# Altium schematic sheet Power.SchDoc: RespiraWorks
size A3; CompanyName: RespiraWorks; DrawnBy: E. Chiu; Organization: Altium; DocumentNumber: 2; Revision: A1; SheetNumber: 2; SheetTotal: 8; PageSetup: Record=PageOptions|CenterHorizontal=True|CenterVertical=True|PrintScale=0.67|XCorrection=1.00|YCorrection=1.00|PrintKind=0|BorderSize=5000000|LeftOffset=0|BottomOffset=0|Orientation=2|PaperLength=1000|PaperWidth=1000|Scale=100|PaperSource=276|PrintQuality=-3|MediaType=1|DitherType=10|PrintScaleMode=1|PaperKind=11"x17" 279.4x431.8mm|PaperIndex=3; ProjectName: FALCON 3S
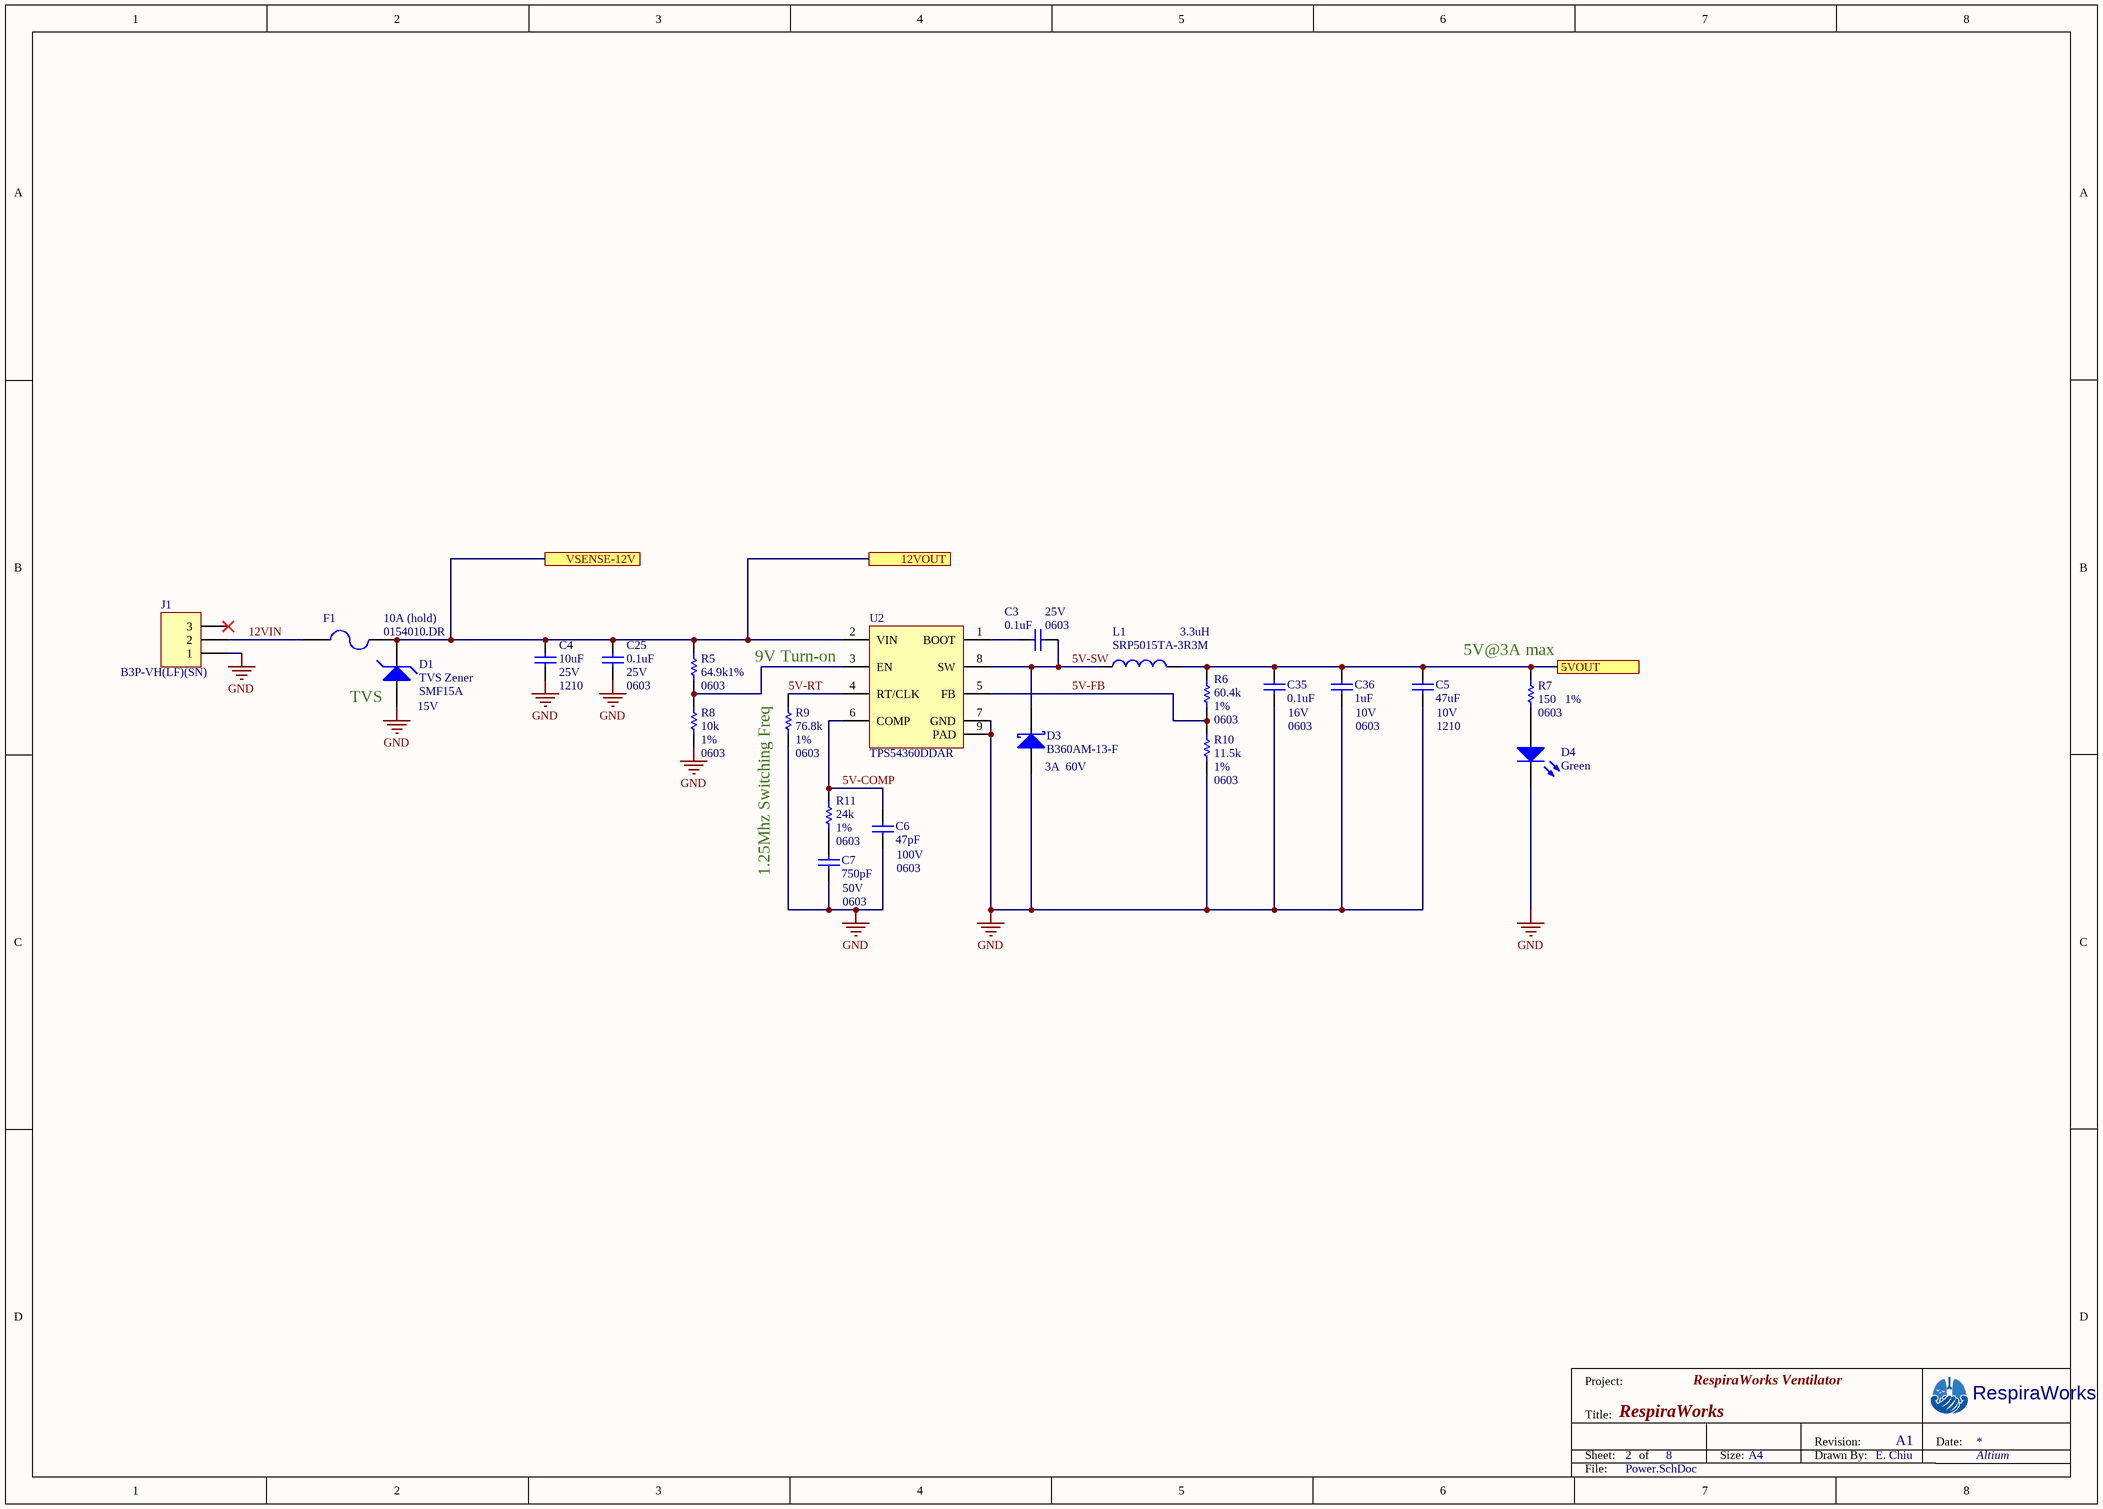
[diagram p0: Power.SchDoc]

## Parts
C3  value 0.1uF  Voltage: 25V  PCB Package: 0603  [CAP0603]  (hidden comment: CAP 0603)
C4  value 10uF  Voltage: 25V  PCB Package: 1210  [CAP1210]  (hidden comment: CAP 1210)
C5  value 47uF  Voltage: 10V  PCB Package: 1210  [CAP1210]  (hidden comment: CAP 1210)
C6  value 47pF  Voltage: 100V  PCB Package: 0603  [CAP0603]  (hidden comment: CAP 0603)
C7  value 750pF  Voltage: 50V  PCB Package: 0603  [CAP0603]  (hidden comment: CAP 0603)
C25  value 0.1uF  Voltage: 25V  PCB Package: 0603  [CAP0603]  (hidden comment: CAP 0603)
C35  value 0.1uF  Voltage: 16V  PCB Package: 0603  [CAP0603]  (hidden comment: CAP 0603)
C36  value 1uF  Voltage: 10V  PCB Package: 0603  [CAP0603]  (hidden comment: CAP 0603)
D1  TVS Zener  Vr: 15V  [SOD-123F]
D3  Reverse Voltage: 60V  I(max): 3A  [DO-214AC]  (hidden comment: *)
D4  value Green  [LED0603]  (hidden comment: LED 0603)
F1  value 10A (hold)  Manufacturer P/N: 0154010.DR  [0154]  (hidden comment: Fast Blow)
J1  B3P-VH(LF)(SN)  [B3P-VH(LF)(SN)]
L1  value 3.3uH  [SRP5015]  (hidden comment: SRP5015TA-3R3M)
R5  value 64.9k  PCB Package: 0603  Tolerance: 1%  [RES0603]  (hidden comment: RES 0603)
R6  value 60.4k  PCB Package: 0603  Tolerance: 1%  [RES0603]  (hidden comment: RES 0603)
R7  value 150  PCB Package: 0603  Tolerance: 1%  [RES0603]  (hidden comment: RES 0603)
R8  value 10k  PCB Package: 0603  Tolerance: 1%  [RES0603]  (hidden comment: RES 0603)
R9  value 76.8k  PCB Package: 0603  Tolerance: 1%  [RES0603]  (hidden comment: RES 0603)
R10  value 11.5k  PCB Package: 0603  Tolerance: 1%  [RES0603]  (hidden comment: RES 0603)
R11  value 24k  PCB Package: 0603  Tolerance: 1%  [RES0603]  (hidden comment: RES 0603)
U2  Manufacturer P/N: TPS54360DDAR  [DDA]  (hidden comment: TPS54360)

## Ports
5VOUT, 12VOUT, VSENSE-12V

## Nets
GND: C4.1 C5.1 C6.1 C7.1 C25.2 C35.2 C36.2 D1.A D3.A D4.K J1.1 R8.1 R9.1 R10.1 U2.7(GND) U2.9(PAD)
5V-COMP: C6.2 R11.2 U2.6(COMP)
5V-FB: R6.1 R10.2 U2.5(FB)
5V-RT: R9.2 U2.4(RT/CLK)
5V-SW: C3.2 D3.K L1.1 U2.8(SW)
5VOUT: C5.2 C35.1 C36.1 L1.2 R6.2 R7.2 ; port 5VOUT
12VIN: F1.1 J1.2
12VOUT: C4.2 C25.1 D1.K F1.2 R5.2 U2.2(VIN) ; port VSENSE-12V, port 12VOUT
NetC3_1: C3.1 U2.1(BOOT)
NetC7_2: C7.2 R11.1
NetD4_A: D4.A R7.1
NetR5_1: R5.1 R8.2 U2.3(EN)

Not connected (* = marked no-connect by the designer): J1 3*

## Notes on the sheet
- (near D1) TVS
- 9V Turn-on
- (near R7) 5V@3A max
- (near R9) 1.25Mhz Switching Freq
- Project:
- RespiraWorks Ventilator
- Title:
- Sheet:
- of
- Size:
- A4
- Drawn By:
- Revision:
- Date:
- File:

## Library data of the parts
C3 C25 = CAP 0603: Manufacturer P/N: CC0603KRX7R8BB104; Manufacturer: Yageo; Type: X7R; Do Not Populate: *
C4 = CAP 1210: Manufacturer P/N: GRM32DR71E106KA12L; Manufacturer: Murata; Type: X7R; Do Not Populate: *
C5 = CAP 1210: Manufacturer P/N: GRM32ER71A476KE15L; Manufacturer: Murata; Type: X7R; Do Not Populate: *
C6 = CAP 0603: Manufacturer P/N: C0603C470J1GACTU; Manufacturer: Kemet; Type: NP0; Do Not Populate: *
C7 = CAP 0603: Manufacturer P/N: CL10B751KB8NNNC; Manufacturer: Samsung; Type: X7R; Do Not Populate: *
C35 = CAP 0603: Manufacturer P/N: CC0603KRX7R7BB104; Manufacturer: Yageo; Type: X7R; Do Not Populate: *
C36 = CAP 0603: Manufacturer P/N: CC0603KRX7R6BB105; Manufacturer: Yageo; Type: X7R; Do Not Populate: *
D1 = SMF15A: TVS Diode, Zener, 15V Standoff, 24V Clamp, 8.2A; Manufacturer: Littelfuse; Vbr(min): 16.7V; Do Not Populate: *; PCB Package: SOD-123F; I(pulse): 8.2A; Manufacturer P/N: SMF15A
D3 = B360AM-13-F: DIODE SCHOTTKY 60V 3A SMA; Manufacturer: Diodes Inc.; PCB Package: DO-214AC (SMA); Do Not Populate: *; Type: Schottky; Manufacturer P/N: B360AM-13-F
D4 = LED 0603: Manufacturer P/N: LTST-C191KGKT; Manufacturer: Lite-On; PCB Package: 0603; Vf: 2V; Intensity: 35mcd@20mA; Color: Green; Do Not Populate: *
F1 = 0154010: Fast Blow Nano Fuse in Holder, 10A, 125V; Manufacturer: Littelfuse; V(max): 125V AC/DC; I(hold): 10A; I(trip): 10A
J1 = B3P-VH(LF)(SN): JST-VH HEADER VERT 3POS 3.96MM; Manufacturer: JST; Do Not Populate: *; Manufacturer P/N: B3P-VH(LF)(SN)
L1 = SRP5015TA-3R3M: Inductor, 501 Series, Shielded 2.2uH, 4A; Manufacturer: Bourns; I(rms): 3.2A; I(sat): 4.5A; DCR: 78mohm; Do Not Populate: *; PCB Package: SRP5015; Manufacturer P/N: SRP5015TA-3R3M
R5 = RES 0603: Manufacturer P/N: RC0603FR-0764K9L; Manufacturer: Yageo; Do Not Populate: *
R6 = RES 0603: Manufacturer P/N: RC0603FR-0760K4L; Manufacturer: Yageo; Do Not Populate: *
R7 = RES 0603: Manufacturer P/N: ERJ-3EKF1500V; Manufacturer: Panasonic; Do Not Populate: *
R8 = RES 0603: Manufacturer P/N: ERJ-3EKF1002V; Manufacturer: Panasonic; Do Not Populate: *
R9 = RES 0603: Manufacturer P/N: RC0603FR-0776K8L; Manufacturer: Yageo; Do Not Populate: *
R10 = RES 0603: Manufacturer P/N: RC0603FR-0711K5L; Manufacturer: Yageo; Do Not Populate: *
R11 = RES 0603: Manufacturer P/N: ERJ-3EKF2402V; Manufacturer: Panasonic; Do Not Populate: *
U2 = TPS54360: DC-DC Buck, 60V Input, 3.5A Int Sw, Ultra Low Quiescent Power; Manufacturer: Texas Instruments; PCB Package: SOIC8; Do Not Populate: *